# Altium schematic sheet bdk2m_comm.SchDoc: =GlobalProjectName
size 209 x 297 mm; SheetNumber: 1; SheetTotal: 6; PageSetup: Record=PageOptions|CenterHorizontal=True|CenterVertical=True|PrintScale=1.00|XCorrection=1.00|YCorrection=1.00|PrintKind=1|BorderSize=5000000|LeftOffset=0|BottomOffset=0|Orientation=2|PaperLength=1000|PaperWidth=1000|Scale=100|PaperSource=15|PrintQuality=1200|MediaType=1|DitherType=10|PaperKind=A3|PrintScaleMode=1; Weight: -; ScaleFactor: -
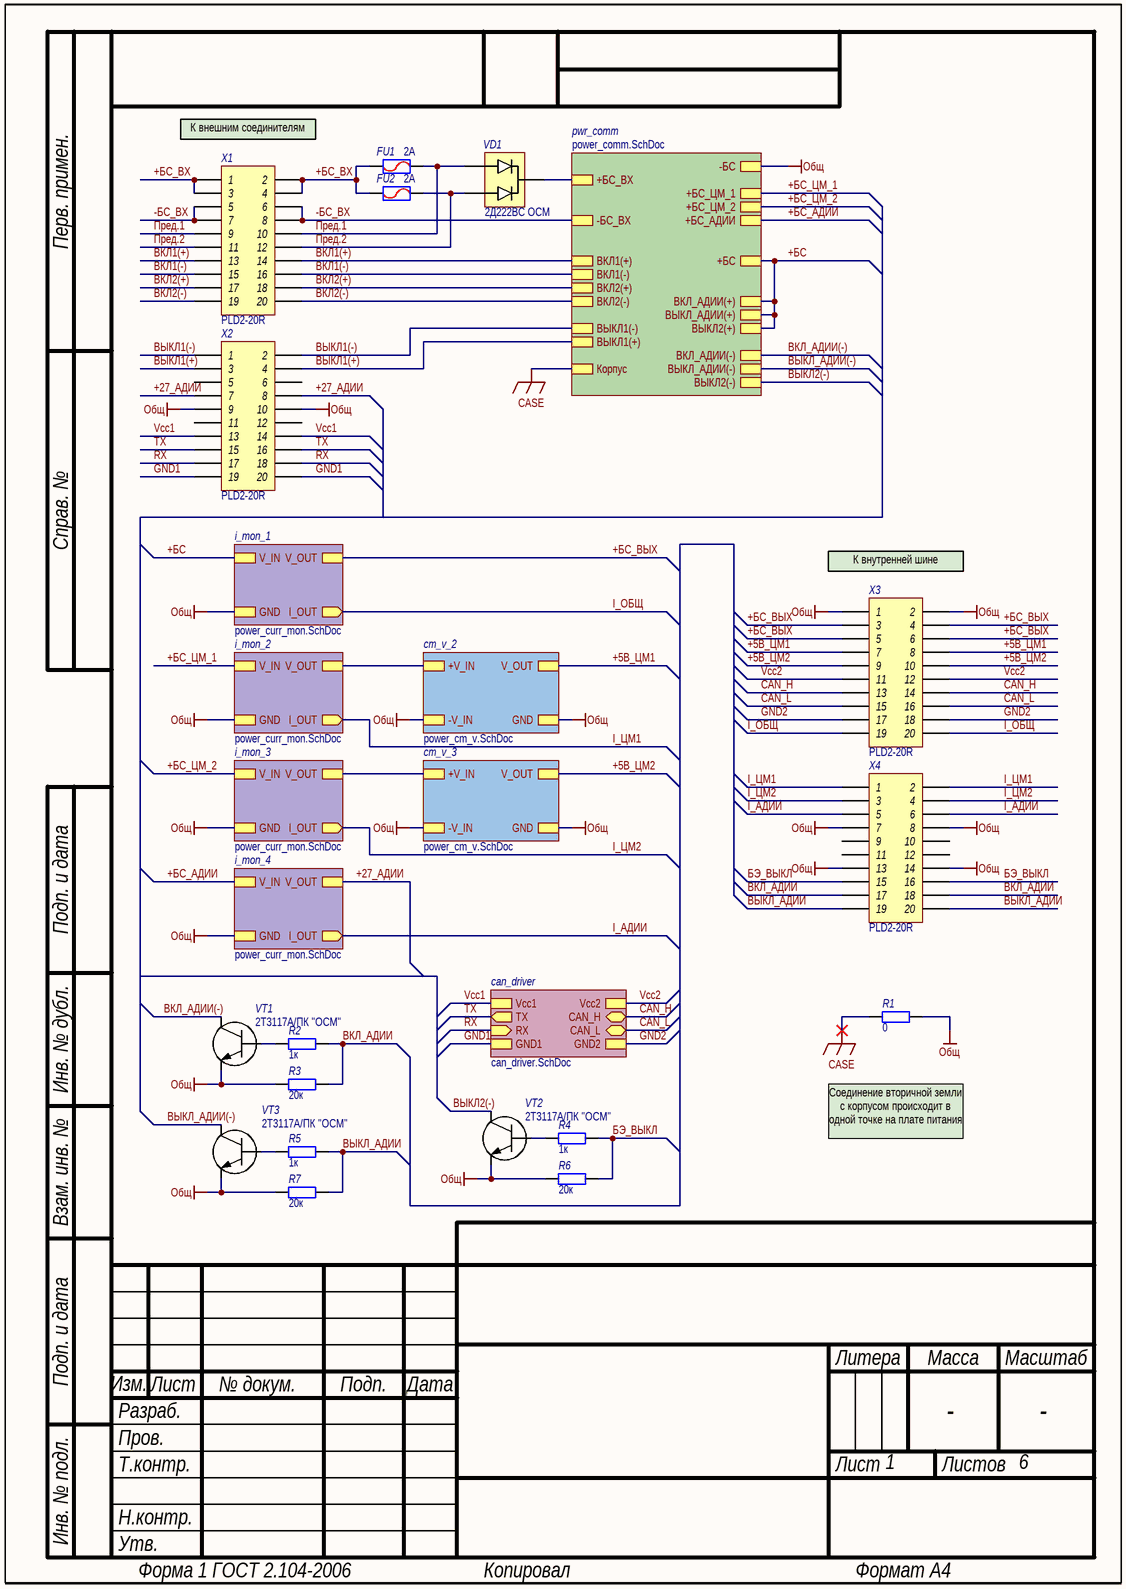
[diagram p0: bdk2m_comm.SchDoc]

## Parts
FU1  value 2A  [VP1-2]  (hidden comment: VP1-2)
FU2  value 2A  [VP1-2]  (hidden comment: VP1-2)
R1  0  [SMD_0805]
R2  1к  [SMD_0805]
R3  20к  [SMD_0805]
R4  1к  [SMD_0805]
R5  1к  [SMD_0805]
R6  20к  [SMD_0805]
R7  20к  [SMD_0805]
VD1  Наименование: 2Д222ВС ОСМ  [4116.4-3_offcut]  (hidden comment: 2D222VS "OSM")
VT1  Наименование: 2Т3117А/ПК "ОСМ"  [TO-18]  (hidden comment: 2T3117A)
VT2  Наименование: 2Т3117А/ПК "ОСМ"  [TO-18]  (hidden comment: 2T3117A)
VT3  Наименование: 2Т3117А/ПК "ОСМ"  [TO-18]  (hidden comment: 2T3117A)
X1  Header 2X10  [PLD2-20R]  (value not drawn)
X2  Header 2X10  [PLD2-20R]  (value not drawn)
X3  Header 2X10  [PLD2-20R]  (value not drawn)
X4  Header 2X10  [PLD2-20R]  (value not drawn)

## Sub-sheets
can_driver = can_driver.SchDoc: TX (out), CAN_H (bidir), Vcc2, GND2, Vcc1, CAN_L (bidir), RX (in), GND1
cm_v_2 = power_cm_v.SchDoc: GND, V_OUT, -V_IN, +V_IN
cm_v_3 = power_cm_v.SchDoc: GND, V_OUT, -V_IN, +V_IN
i_mon_1 = power_curr_mon.SchDoc: I_OUT (out), V_IN, V_OUT, GND
i_mon_2 = power_curr_mon.SchDoc: I_OUT (out), V_IN, V_OUT, GND
i_mon_3 = power_curr_mon.SchDoc: I_OUT (out), V_IN, V_OUT, GND
i_mon_4 = power_curr_mon.SchDoc: I_OUT (out), V_IN, V_OUT, GND
pwr_comm = power_comm.SchDoc: ВЫКЛ1(-), -БС, ВЫКЛ1(+), -БС_ВХ, ВКЛ1(+), ВКЛ2(-), +БС_ВХ, +БС_ЦМ_1, ВКЛ_АДИИ(+), ВЫКЛ2(-), ВКЛ2(+), ВКЛ1(-), +БС, +БС_АДИИ, ВЫКЛ_АДИИ(+), ВЫКЛ2(+), +БС_ЦМ_2, Корпус, ВКЛ_АДИИ(-), ВЫКЛ_АДИИ(-)

## Nets
CASE: R1.1 ; sheet pwr_comm/Корпус
Общ: R1.2 R3.1 R6.1 R7.1 VT1.1(EMITTER) VT2.1(EMITTER) VT3.1(EMITTER) X2.9 X2.10 X3.1 X3.2 X4.7 X4.8 X4.13 X4.14 ; sheet pwr_comm/-БС, sheet cm_v_2/GND, sheet cm_v_2/-V_IN, sheet i_mon_2/GND, sheet i_mon_3/GND, sheet i_mon_1/GND, sheet i_mon_4/GND, sheet cm_v_3/GND, sheet cm_v_3/-V_IN
+5В_ЦМ1: X3.7 X3.8 ; sheet cm_v_2/V_OUT
+5В_ЦМ2: X3.9 X3.10 ; sheet cm_v_3/V_OUT
+27_АДИИ: X2.7 X2.8 ; sheet i_mon_4/V_OUT
+БС: sheet pwr_comm/ВКЛ_АДИИ(+), sheet pwr_comm/+БС, sheet pwr_comm/ВЫКЛ_АДИИ(+), sheet pwr_comm/ВЫКЛ2(+), sheet i_mon_1/V_IN
+БС_АДИИ: sheet pwr_comm/+БС_АДИИ, sheet i_mon_4/V_IN
+БС_ВХ: FU1.1 FU2.1 X1.1 X1.2 X1.3 X1.4
+БС_ВЫХ: X3.3 X3.4 X3.5 X3.6 ; sheet i_mon_1/V_OUT
+БС_ЦМ_1: sheet pwr_comm/+БС_ЦМ_1, sheet i_mon_2/V_IN
+БС_ЦМ_2: sheet pwr_comm/+БС_ЦМ_2, sheet i_mon_3/V_IN
-БС_ВХ: X1.5 X1.6 X1.7 X1.8 ; sheet pwr_comm/-БС_ВХ
CAN_H: X3.13 X3.14 ; sheet can_driver/CAN_H
CAN_L: X3.15 X3.16 ; sheet can_driver/CAN_L
GND1: X2.19 X2.20 ; sheet can_driver/GND1
GND2: X3.17 X3.18 ; sheet can_driver/GND2
I_АДИИ: X4.5 X4.6 ; sheet i_mon_4/I_OUT
I_ОБЩ: X3.19 X3.20 ; sheet i_mon_1/I_OUT
I_ЦМ1: X4.1 X4.2 ; sheet i_mon_2/I_OUT
I_ЦМ2: X4.3 X4.4 ; sheet i_mon_3/I_OUT
RX: X2.17 X2.18 ; sheet can_driver/RX
TX: X2.15 X2.16 ; sheet can_driver/TX
Vcc1: X2.13 X2.14 ; sheet can_driver/Vcc1
Vcc2: X3.11 X3.12 ; sheet can_driver/Vcc2
БЭ_ВЫКЛ: R4.2 R6.2 X4.15 X4.16
ВКЛ1(+): X1.13 X1.14 ; sheet pwr_comm/ВКЛ1(+)
ВКЛ1(-): X1.15 X1.16 ; sheet pwr_comm/ВКЛ1(-)
ВКЛ2(+): X1.17 X1.18 ; sheet pwr_comm/ВКЛ2(+)
ВКЛ2(-): X1.19 X1.20 ; sheet pwr_comm/ВКЛ2(-)
ВКЛ_АДИИ: R2.2 R3.2 X4.17 X4.18
ВКЛ_АДИИ(-): VT1.3(COLLECTOR) ; sheet pwr_comm/ВКЛ_АДИИ(-)
ВЫКЛ1(+): X2.3 X2.4 ; sheet pwr_comm/ВЫКЛ1(+)
ВЫКЛ1(-): X2.1 X2.2 ; sheet pwr_comm/ВЫКЛ1(-)
ВЫКЛ2(-): VT2.3(COLLECTOR) ; sheet pwr_comm/ВЫКЛ2(-)
ВЫКЛ_АДИИ: R5.2 R7.2 X4.19 X4.20
ВЫКЛ_АДИИ(-): VT3.3(COLLECTOR) ; sheet pwr_comm/ВЫКЛ_АДИИ(-)
Пред.1: FU1.2 VD1.11 X1.9 X1.10
Пред.2: FU2.2 VD1.17 X1.11 X1.12
NetR2_1: R2.1 VT1.2(BASE)
NetR4_1: R4.1 VT2.2(BASE)
NetR5_1: R5.1 VT3.2(BASE)
NetVD1_8: VD1.8 ; sheet pwr_comm/+БС_ВХ
(unnamed): sheet cm_v_2/+V_IN, sheet i_mon_2/V_OUT
(unnamed): sheet i_mon_3/V_OUT, sheet cm_v_3/+V_IN

Not connected (* = marked no-connect by the designer): X2 5 6 11 12; X4 9 10 11 12

## Notes on the sheet
- (near X1) К внешним соединителям
- (near X3) К внутренней шине
- Соединение вторичной земли с корпусом происходит в одной точке на плате питания
- Перв. примен.
- Справ. №
- Подп. и дата
- Инв. № дубл.
- Взам. инв. №
- Разраб.
- Изм.
- Лист
- № докум.
- Подп.
- Дата
- Литера
- Масса
- Масштаб
- Пров.
- Т.контр.
- Листов
- Инв. № подл.
- Н.контр.
- Утв.
- Форма 1 ГОСТ 2.104-2006
- Копировал
- Формат А4

## Library data of the parts
FU1 FU2 = VP1-2: Предохранитель плавкий; Наименование: ВП1-2 "ВП"; Назначение: Предохранитель плавкий; ComponentLink1Description: DataSheet; ComponentLink1URL: https://docviewer.yandex.ru/view/20572601/?page=1&*=oYyHA%2BCwzeyRvrmOJV6%2ByaBlbHJ7InVybCI6Imh0dHBzOi8vZWwtcmEucnUvdXBsb2FkL2libG9jay8wMTYvdnN0YXZrYS1wbGF2a2EtdnAxXzItX2VsZWt0cm9uaWthX3JhXy5wZGYiLCJ0aXRsZSI6InZzdGF2a2EtcGxhdmthLXZwMV8yLV9lbGVrdHJvbmlrYV9yYV8ucGRmIiwibm9pZnJhbWUiOnRydWUsInVpZCI6IjIwNTcyNjAxIiwidHMiOjE1OTI0NzI0NTM1MTUsInl1IjoiODg5MDYxMzMxNTQzMzg3MTIxIiwic2VycFBhcmFtcyI6Imxhbmc9cnUmdG09MTU5MjQ3MjQyOCZ0bGQ9cnUmbmFtZT12c3RhdmthLXBsYXZrYS12cDFfMi1fZWxla3Ryb25pa2FfcmFfLnBkZiZ0ZXh0PSVEMCVCMiVEMCVCRjEtMiZ1cmw9aHR0cHMlM0EvL2VsLXJhLnJ1L3VwbG9hZC9pYmxvY2svMDE2L3ZzdGF2a2EtcGxhdmthLXZwMV8yLV9lbGVrdHJvbmlrYV9yYV8ucGRmJmxyPTY1Jm1pbWU9cGRmJmwxMG49cnUmc2lnbj0yZWMwNDRiZDQyMGRlMjRmMjI1MThkNTc4YjZlMTlkYiZrZXlubz0wIn0%3D&lang=ru
R1-R7 = Resistor: Наименование: Резистор; Назначение: SMD-резистор; Потребление, Вт: 0,001
  R1: Value: 0
  R2 R4 R5: Value: 1к
  R3 R6 R7: Value: 20к
VD1 = 2D222: Сдвоенный диод; Потребление, Вт: 0,004; Назначение: Сдвоенный диод; ComponentLink1Description: DataSheet; ComponentLink1URL: https://eandc.ru/pdf/diod/2d222.pdf
VT1-VT3 = 2T3117A: Кремниевый биполярный / эпитаксиально-планарный / n-p-n транзистор; Назначение: Биполярный транзистор; Потребление, Вт: 0,0; ComponentLink1Description: DataSheet; ComponentLink1URL: https://www.integral.by/sites/default/files/pdf/2t3117.pdf
X1-X4 = PLD2-20: Header, 12-Pin, Dual row; Назначение: Header, 20-Pin, Dual row; Потребление, Вт: 0,0; Наименование: PLD2-20R